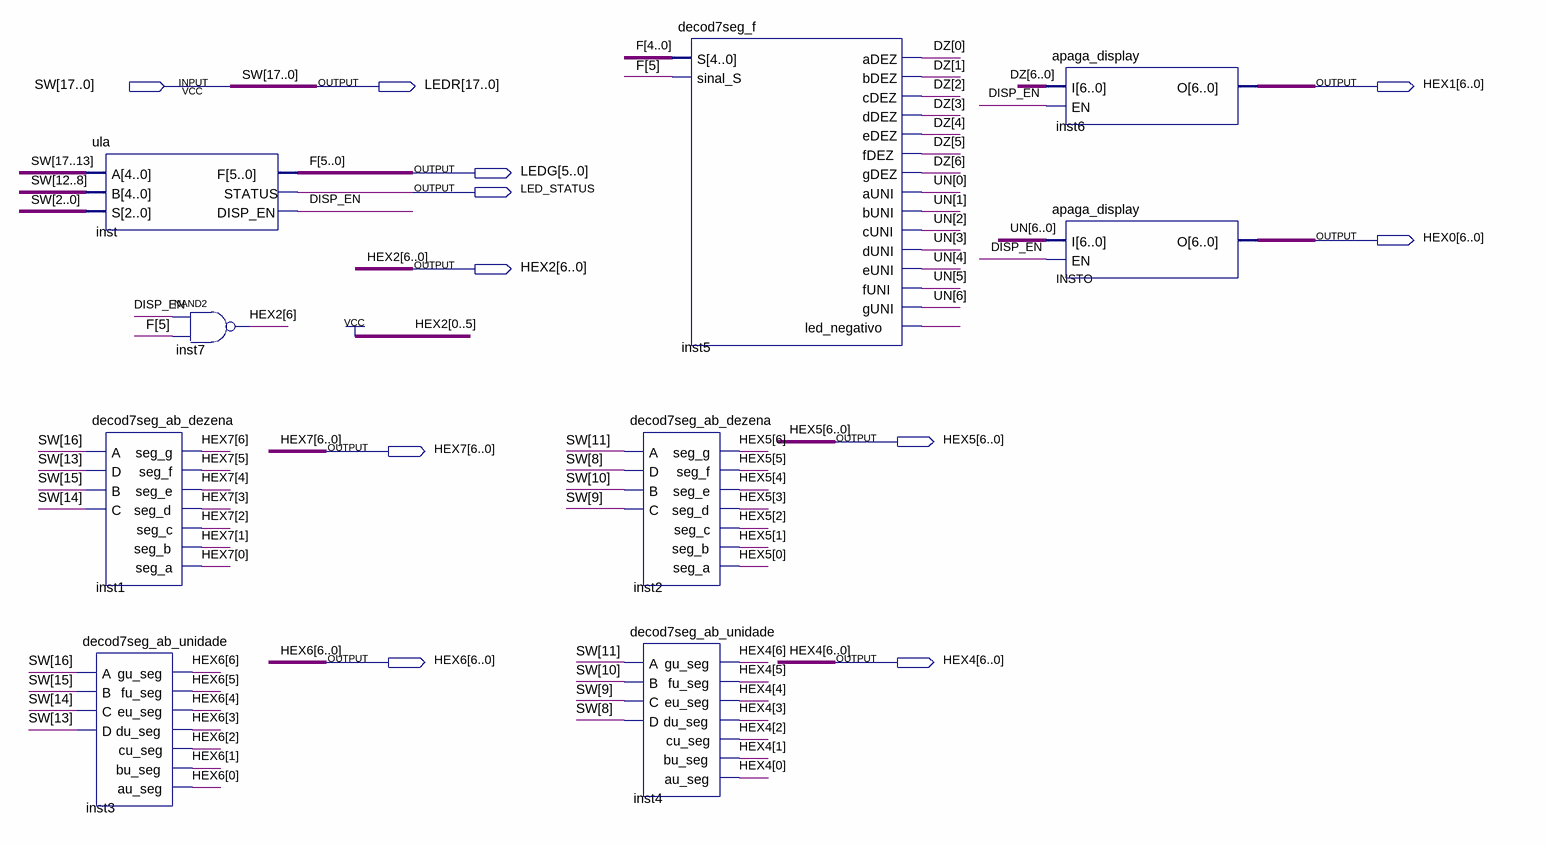
[diagram p0: schematic sheet]
// Quartus schematic toplevel.bdf as structural Verilog: 9 symbols, 11 pins
module toplevel (
  input  [17:0] SW,
  output [17:0] LEDR,
  output [6:0] HEX1,
  output [5:0] LEDG,
  output LED_STATUS,
  output [6:0] HEX0,
  output [6:0] HEX2,
  output [6:0] HEX5,
  output [6:0] HEX7,
  output [6:0] HEX6,
  output [6:0] HEX4
);

  wire DISP_EN, inst5_led_negativo;
  wire [6:0] DZ, UN;

  ula inst (.A(SW[17:13]), .B(SW[12:8]), .S(SW[2:0]), .F(LEDG), .STATUS(LED_STATUS), .DISP_EN(DISP_EN));
  decod7seg_ab_dezena inst1 (
    .A(SW[16]), .D(SW[13]), .B(SW[15]), .C(SW[14]), .seg_g(HEX7[6]), .seg_f(HEX7[5]), .seg_e(HEX7[4]),
    .seg_d(HEX7[3]), .seg_c(HEX7[2]), .seg_b(HEX7[1]), .seg_a(HEX7[0]));
  decod7seg_ab_unidade inst3 (
    .A(SW[16]), .B(SW[15]), .C(SW[14]), .D(SW[13]), .gu_seg(HEX6[6]), .fu_seg(HEX6[5]), .eu_seg(HEX6[4]),
    .du_seg(HEX6[3]), .cu_seg(HEX6[2]), .bu_seg(HEX6[1]), .au_seg(HEX6[0]));
  nand inst7 (HEX2[6], DISP_EN, LEDG[5]);
  decod7seg_ab_dezena inst2 (
    .A(SW[11]), .D(SW[8]), .B(SW[10]), .C(SW[9]), .seg_g(HEX5[6]), .seg_f(HEX5[5]), .seg_e(HEX5[4]),
    .seg_d(HEX5[3]), .seg_c(HEX5[2]), .seg_b(HEX5[1]), .seg_a(HEX5[0]));
  decod7seg_ab_unidade inst4 (
    .A(SW[11]), .B(SW[10]), .C(SW[9]), .D(SW[8]), .gu_seg(HEX4[6]), .fu_seg(HEX4[5]), .eu_seg(HEX4[4]),
    .du_seg(HEX4[3]), .cu_seg(HEX4[2]), .bu_seg(HEX4[1]), .au_seg(HEX4[0]));
  decod7seg_f inst5 (
    .S(LEDG[4:0]), .sinal_S(LEDG[5]), .aDEZ(DZ[0]), .bDEZ(DZ[1]), .cDEZ(DZ[2]), .dDEZ(DZ[3]), .eDEZ(DZ[4]),
    .fDEZ(DZ[5]), .gDEZ(DZ[6]), .aUNI(UN[0]), .bUNI(UN[1]), .cUNI(UN[2]), .dUNI(UN[3]), .eUNI(UN[4]),
    .fUNI(UN[5]), .gUNI(UN[6]), .led_negativo(inst5_led_negativo));
  apaga_display inst6 (.I(DZ), .EN(DISP_EN), .O(HEX1));
  apaga_display INSTO (.I(UN), .EN(DISP_EN), .O(HEX0));

  assign HEX2[5:0] = {6{1'b1}};
  assign LEDR = SW;

  // Other names for the same wires on the sheet: F[5:0] = LEDG
endmodule
